# EAGLE design Pixie84Servo (EAGLE 7.5.0)
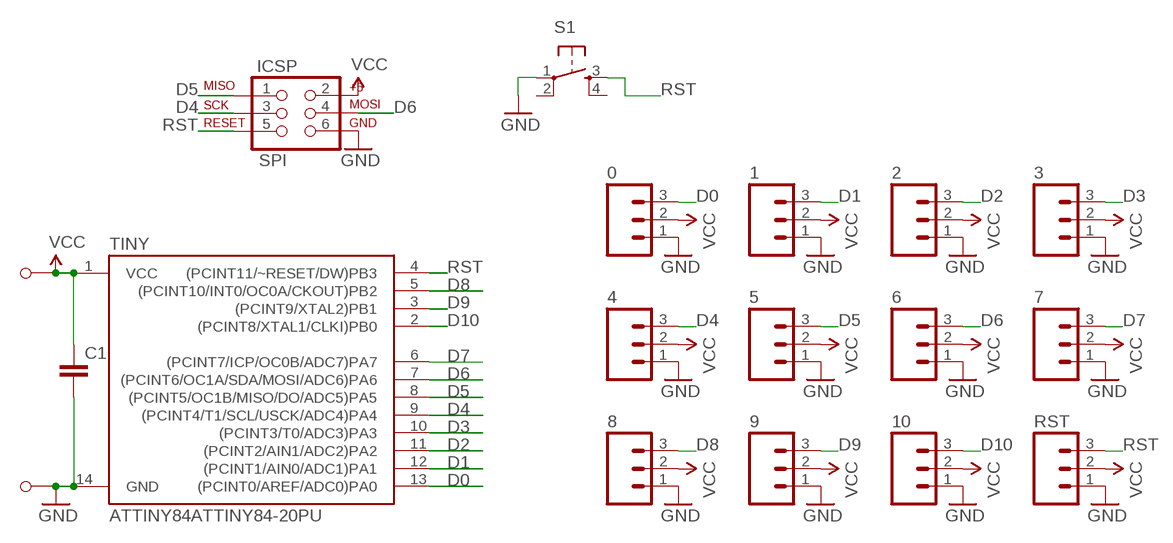
[diagram p0: schematic, sheet 1]

## Parts
0  M03PTH  [1X03]
1  M03PTH  [1X03]
2  M03PTH  [1X03]
3  M03PTH  [1X03]
4  M03PTH  [1X03]
5  M03PTH  [1X03]
6  M03PTH  [1X03]
7  M03PTH  [1X03]
8  M03PTH  [1X03]
9  M03PTH  [1X03]
10  M03PTH  [1X03]
C1  CAPPTH  [CAP-PTH-SMALL]
ICSP  SPI  AVR_SPI_PRG_6LABELED  [2X3-NS]
RST  M03PTH  [1X03]
S1  TAC_SWITCHPTH  [TACTILE-PTH]
TINY  ATTINY84ATTINY84-20PU  [DIL14]
U$1  M1  [M1_NO_STRAIN]
U$2  M1  [M1_NO_STRAIN]

## Nets
D0: 0.3 TINY.13((PCINT0/AREF/ADC0)PA0)
D1: 1.3 TINY.12((PCINT1/AIN0/ADC1)PA1)
D2: 2.3 TINY.11((PCINT2/AIN1/ADC2)PA2)
D3: 3.3 TINY.10((PCINT3/T0/ADC3)PA3)
D4: 4.3 ICSP.3(SCK) TINY.9((PCINT4/T1/SCL/USCK/ADC4)PA4)
D5: 5.3 ICSP.1(MISO) TINY.8((PCINT5/OC1B/MISO/DO/ADC5)PA5)
D6: 6.3 ICSP.4(MOSI) TINY.7((PCINT6/OC1A/SDA/MOSI/ADC6)PA6)
D7: 7.3 TINY.6((PCINT7/ICP/OC0B/ADC7)PA7)
D8: 8.3 TINY.5((PCINT10/INT0/OC0A/CKOUT)PB2)
D9: 9.3 TINY.3((PCINT9/XTAL2)PB1)
D10: 10.3 TINY.2((PCINT8/XTAL1/CLKI)PB0)
GND: 0.1 1.1 2.1 3.1 4.1 5.1 6.1 7.1 8.1 9.1 10.1 C1.2 ICSP.6(GND) RST.1 S1.1 TINY.14(GND) U$2.P$1
RST: ICSP.5(RST) RST.3 S1.3 TINY.4((PCINT11/~RESET/DW)PB3)
VCC: 0.2 1.2 2.2 3.2 4.2 5.2 6.2 7.2 8.2 9.2 10.2 C1.1 ICSP.2(V+) RST.2 TINY.1(VCC) U$1.P$1
Unconnected: S1.2 S1.4

## Library data of the parts
0 1-10 RST = SparkFun-Connectors:M03: Header 3 Standard 3-pin 0.1" header. Use with straight break away headers (SKU : PRT-00116), right angle break away headers (PRT-00553), swiss pins (PRT-00743), machine pins (PRT-00117), and female headers (PRT-00115). Molex polarized connector foot print use with SKU : PRT-08232 with associated crimp pins and housings.
C1 = barbary_enterprises:CAP: Capacitor Standard 0603 ceramic capacitor, and 0.1" leaded capacitor.
ICSP = barbary_enterprises:AVR_SPI_PRG_6: AVR ISP 6 Pin This is the reduced ISP connector for AVR programming. Common on Arduino. This footprint will take up less PCB space and can be used with a 10-pin to 6-pin adapter such as SKU: BOB-08508
S1 = barbary_enterprises:TAC_SWITCH: Momentary Switch Button commonly used for reset or general input. Spark Fun Electronics SKU : COM-00097 SMT- SWCH-08247
TINY = SparkFun-DigitalIC:ATTINY84: Atmel 14-pin 2/4/8kB flash uC
U$1 U$2 = barbary_enterprises:M1

## Board
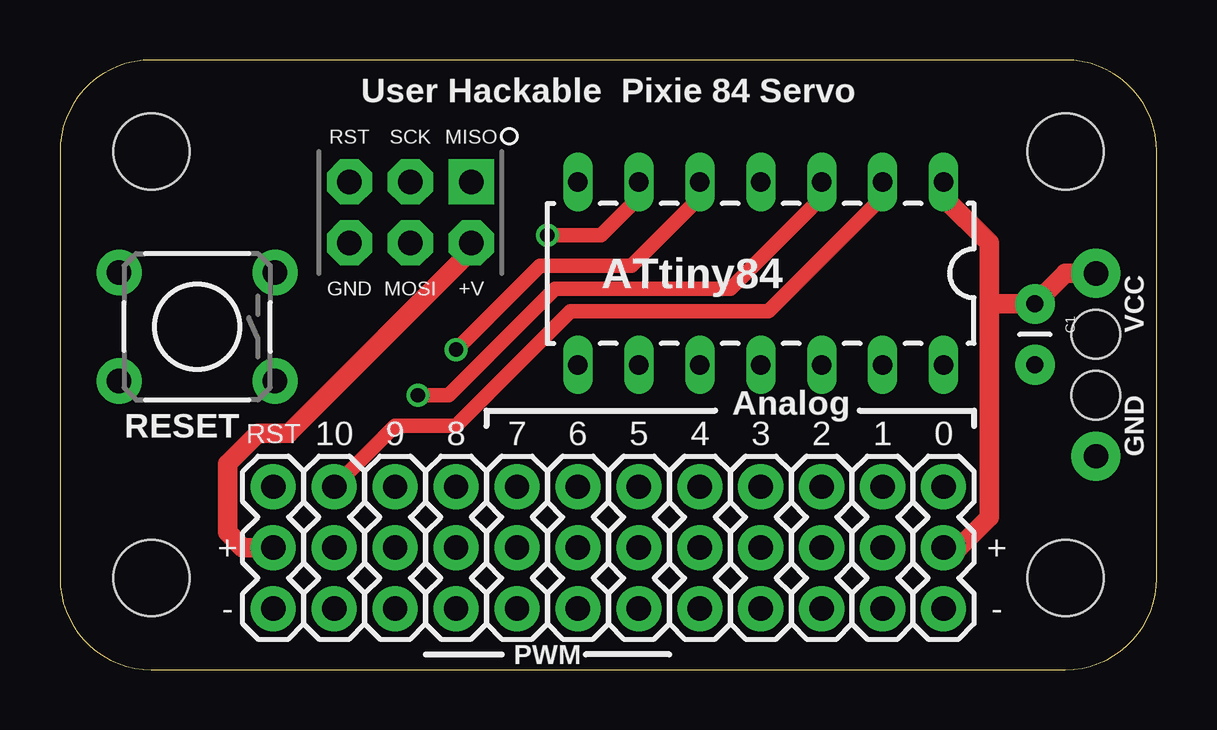
[diagram p1: board, top side]
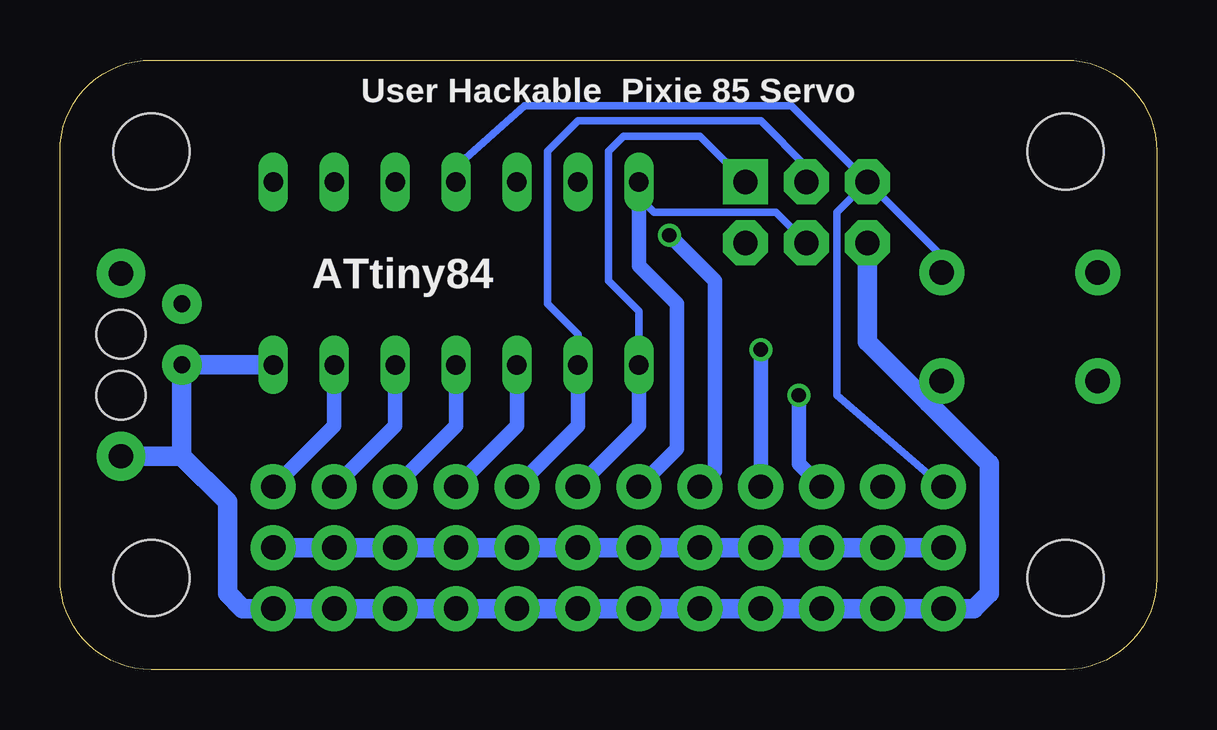
[diagram p2: board, bottom side, seen from below]

Size 45.72 x 25.4 mm. Coordinates in mm from the lower left corner, seen from the top.
Outline: 0,21.59 0,3.81 arc90 3.81,0 41.91,0 arc90 45.72,3.81 45.72,21.59 arc90 41.91,25.4 3.81,25.4 arc90 0,21.59
Copper layers (1*16): Top 0.0356mm / dielectric 1.5011mm / Bottom 0.0356mm
Design rules "LaenPCBOrder": minimum track width 6mil, minimum drill 13mil, track to track 6mil, track to pad 6mil, pad to pad 6mil, via to via 6mil, smd to smd 6mil, copper to edge 15mil, drill to drill 6mil, minimum pad ring 7mil, minimum via ring 7mil, stop-mask expansion 3mil, vias tented up to drill 0mil, thermal gap 10mil
Holes 3.17 mm at 3.81,3.81 41.91,3.81 3.81,21.59 41.91,21.59

### Footprints (pad centres in the part's own frame; a part is rotated, then mirrored left to right if it is on the bottom)
1X03 = drill 1.016 pad 1.88: 1 0,0; 2 2.54,0; 3 5.08,0
CAP-PTH-SMALL = drill 0.7 pad 1.651: 1 0,0; 2 2.54,0
2X3-NS = drill 1.016 pad 1.88 square: 1 -2.54,-1.27 | drill 1.016 pad 1.88 octagon: 2 -2.54,1.27; 3 0,-1.27; 4 0,1.27; 5 2.54,-1.27; 6 2.54,1.27
TACTILE-PTH = drill 1.016 pad 1.88: 1 -3.251,2.261; 2 3.251,2.261; 3 -3.251,-2.261; 4 3.251,-2.261
DIL14 = drill 0.813 long: 1 -8.89,-3.81; 2 -6.35,-3.81; 3 -3.81,-3.81; 4 -1.27,-3.81; 5 1.27,-3.81; 6 3.81,-3.81; 7 6.35,-3.81; 8 6.35,3.81; 9 3.81,3.81; 10 1.27,3.81; 11 -1.27,3.81; 12 -3.81,3.81; 13 -6.35,3.81; 14 -8.89,3.81
M1_NO_STRAIN = drill 1.016 pad 2.032: P$1 0,0 | hole 2.032: 2.54,0

### Placement (x,y rotation side)
0  36.83,2.54 90 top
1  34.29,2.54 90 top
2  31.75,2.54 90 top
3  29.21,2.54 90 top
4  26.67,2.54 90 top
5  24.13,2.54 90 top
6  21.59,2.54 90 top
7  19.05,2.54 90 top
8  16.51,2.54 90 top
9  13.97,2.54 90 top
10  11.43,2.54 90 top
C1  40.64,15.24 270 top
ICSP  14.61,19.05 180 top
RST  8.89,2.54 90 top
S1  5.71,14.29 180 top
TINY  27.94,16.51 180 top
U$1  43.18,16.51 270 top
U$2  43.18,8.89 90 top

### Tracks (layer width: path | path; a pad name or v marks a point on that pad's centre or on a via)
D0
  Bottom 0.61: TINY.13 34.29,10.16 0.3
D1
  Bottom 0.61: TINY.12 31.75,10.16 1.3
D2
  Bottom 0.61: TINY.11 29.21,10.16 2.3
D3
  Bottom 0.61: TINY.10 26.67,10.16 3.3
D4
  Bottom 0.305: TINY.9 24.13,13.97 25.4,15.24 25.4,21.59 24.13,22.86 16.51,22.86 14.61,20.95 ICSP.3
  Bottom 0.61: TINY.9 24.13,10.16 4.3
D5
  Bottom 0.305: TINY.8 21.59,14.92 22.86,16.19 22.86,21.59 22.23,22.23 19.05,22.23 ICSP.1
  Bottom 0.61: TINY.8 21.59,10.16 5.3
D6
  Bottom 0.305: ICSP.4 15.88,19.05 20.95,19.05 21.59,19.68
  Bottom 0.61: TINY.7 21.59,19.68 21.59,16.83 20,15.24 20,9.21 6.3
D7  (via drill 0.6)
  Top 0.61: TINY.6 24.13,19.68 22.54,18.1 v20.32,18.1
  Bottom 0.61: v20.32,18.1 18.41,16.19 18.41,8.26 7.3
D8  (via drill 0.6)
  Top 0.61: TINY.5 26.67,19.68 23.81,16.83 20,16.83 v16.51,13.34
  Bottom 0.61: v16.51,13.34 8.3
D9  (via drill 0.6)
  Top 0.61: TINY.3 31.75,19.68 27.94,15.88 20.64,15.88 16.19,11.43 v14.92,11.43
  Bottom 0.61: v14.92,11.43 14.92,8.57 9.3
D10
  Top 0.61: TINY.2 34.29,19.68 29.53,14.92 21.27,14.92 16.51,10.16 13.97,10.16 10.3
GND
  Bottom 0.813: 40.64,8.89 38.73,6.99 38.73,3.17 38.1,2.54 0.1 1.1 2.1 3.1 4.1 5.1 6.1 7.1 8.1 9.1 10.1 RST.1 7.62,2.54 6.99,3.17 6.99,8.57 9.53,11.11 | U$2.P$1 40.64,8.89 | TINY.14 C1.2 40.64,8.89 | 9.53,11.11 12.06,13.65 ICSP.6 | S1.1 8.97,11.67 9.53,11.11
RST
  Bottom 0.305: ICSP.5 15.24,23.5 26.35,23.5 29.21,20.95 TINY.4 | ICSP.5 13.34,19.05 13.34,11.43 9.53,8.14 RST.3 | S1.3 8.97,17.22 ICSP.5
VCC
  Top 0.813: 0.2 37.47,5.08 38.73,6.35 38.73,15.24 | U$1.P$1 41.91,16.51 C1.1 38.73,15.24 | 38.73,15.24 38.73,17.78 36.83,19.68 TINY.1 | ICSP.2 17.14,17.46 9.53,9.84 8.26,9.84 6.99,8.57 6.99,5.71 7.62,5.08 RST.2
  Bottom 0.813: 0.2 1.2 2.2 3.2 4.2 5.2 6.2 7.2 8.2 9.2 10.2 RST.2

### Text on the board
tPlace: User Hackable Pixie 84 Servo | ATtiny84 | VCC | Analog | RESET | GND | + | + | - | - | PWM
bPlace: User Hackable Pixie 85 Servo | ATtiny84